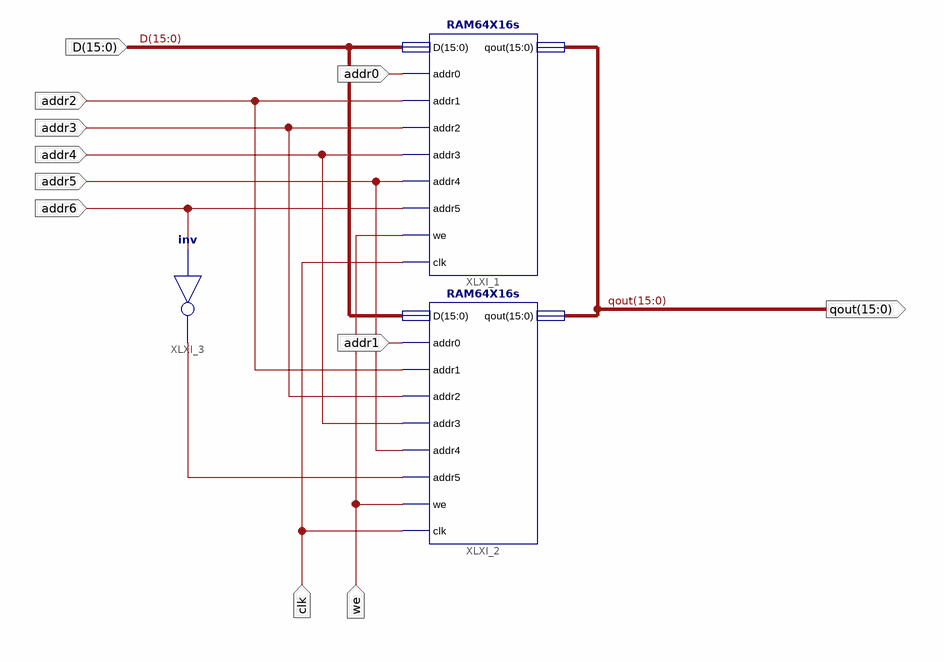
[diagram p0: schematic sheet 1]
// Xilinx ISE schematic RAM128X16s.sch (spartan3e) as structural Verilog: 3 symbols, 11 ports
module RAM128X16s (
  input  [15:0] D,
  input  addr6,
  input  addr5,
  input  addr4,
  input  addr3,
  input  addr2,
  input  addr0,
  input  addr1,
  input  we,
  input  clk,
  output [15:0] qout
);

  wire XLXN_6;

  RAM64X16s XLXI_1 (
    .addr0(addr0), .addr1(addr2), .addr2(addr3), .addr3(addr4), .addr4(addr5), .addr5(addr6), .clk(clk),
    .D(D), .qout(qout), .we(we));
  RAM64X16s XLXI_2 (
    .addr0(addr1), .addr1(addr2), .addr2(addr3), .addr3(addr4), .addr4(addr5), .addr5(XLXN_6), .clk(clk),
    .D(D), .qout(qout), .we(we));
  not XLXI_3 (XLXN_6, addr6);
endmodule
